# Altium schematic sheet P05_Processor Page 3 of 3.SchDoc
size 513 x 386 mm
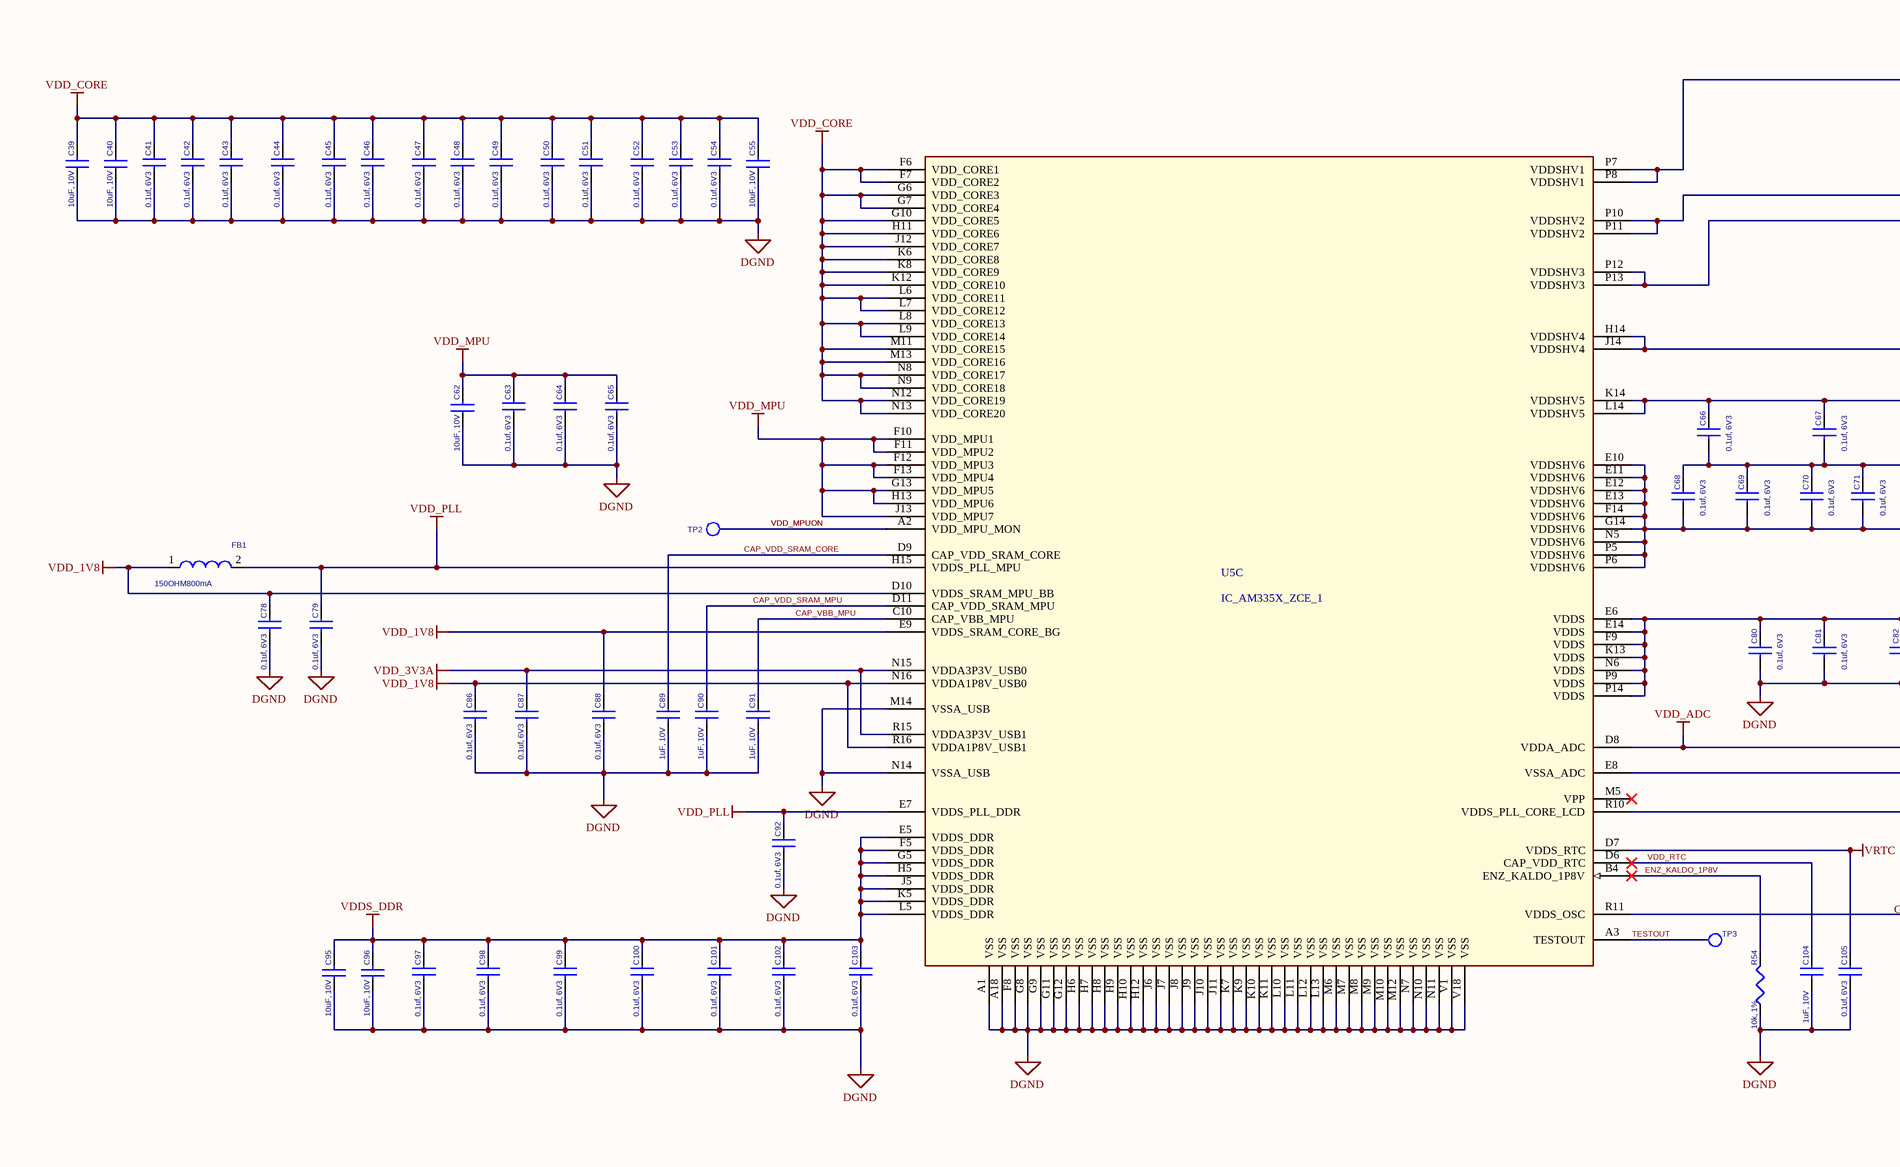
[diagram p0: P05_Processor Page 3 of 3.SchDoc, left]
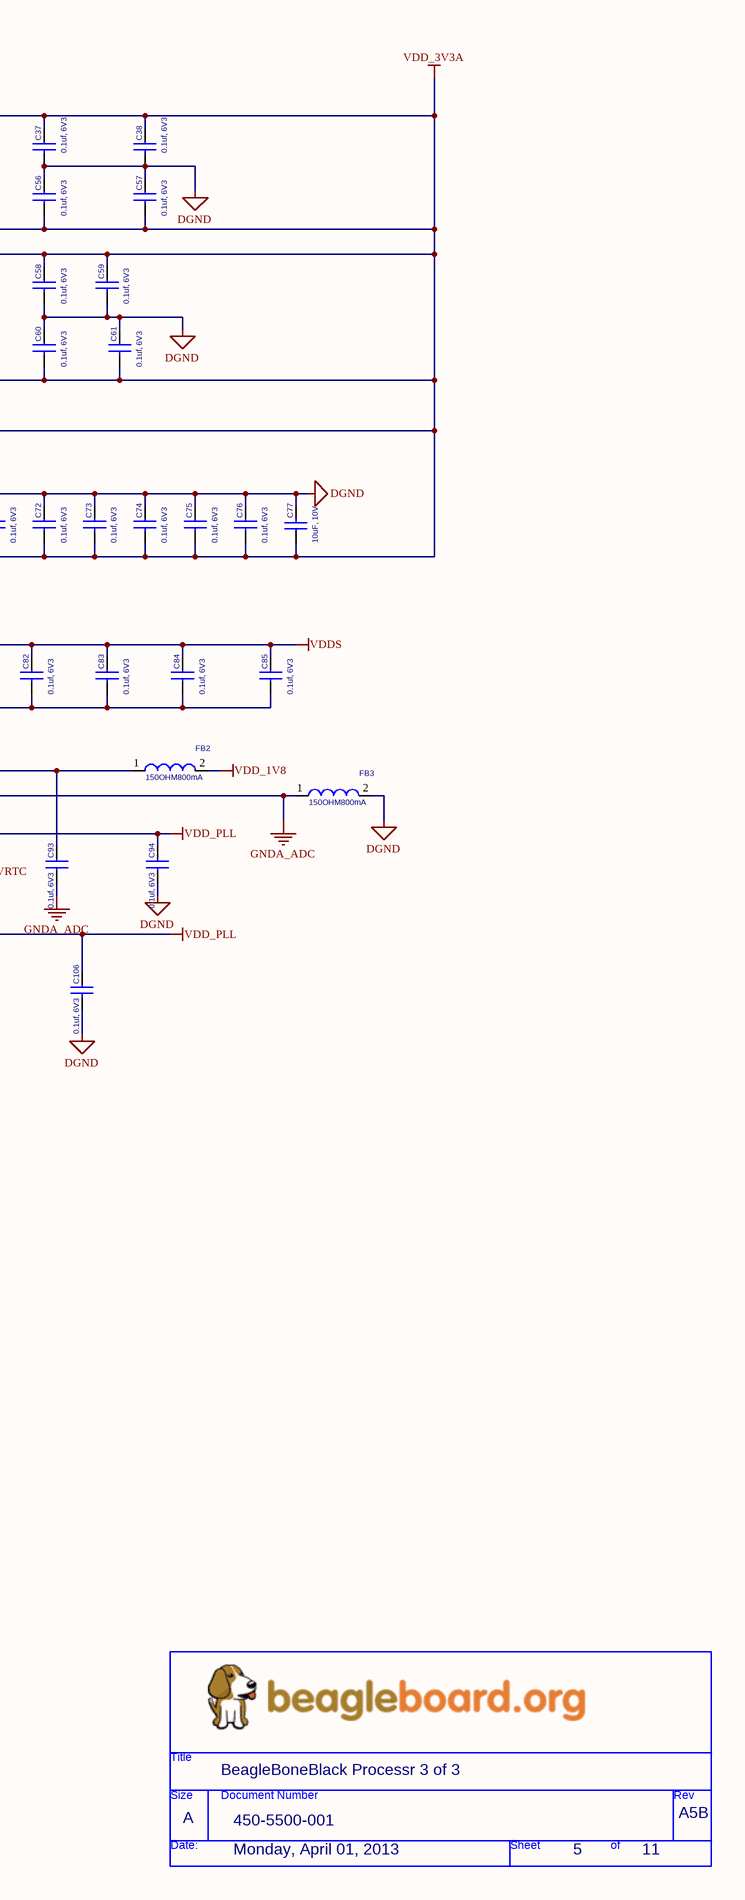
[diagram p1: P05_Processor Page 3 of 3.SchDoc, right]

## Parts
*  Page Create Date: Monday, April 01, 2013  Doc: 450-5500-001  RevCode: A5B  Title: BeagleBoneBlack Processr 3 of 3  Page Size: A  Page Number: 5  Page Count: 11  (hidden comment: BeagleBoard_org)  (graphical)
C37  0.1uf, 6V3  [402]
C38  0.1uf, 6V3  [402]
C39  10uF, 10V  [805]
C40  10uF, 10V  [805]
C41  0.1uf, 6V3  [402]
C42  0.1uf, 6V3  [402]
C43  0.1uf, 6V3  [402]
C44  0.1uf, 6V3  [402]
C45  0.1uf, 6V3  [402]
C46  0.1uf, 6V3  [402]
C47  0.1uf, 6V3  [402]
C48  0.1uf, 6V3  [402]
C49  0.1uf, 6V3  [402]
C50  0.1uf, 6V3  [402]
C51  0.1uf, 6V3  [402]
C52  0.1uf, 6V3  [402]
C53  0.1uf, 6V3  [402]
C54  0.1uf, 6V3  [402]
C55  10uF, 10V  [805]
C56  0.1uf, 6V3  [402]
C57  0.1uf, 6V3  [402]
C58  0.1uf, 6V3  [402]
C59  0.1uf, 6V3  [402]
C60  0.1uf, 6V3  [402]
C61  0.1uf, 6V3  [402]
C62  10uF, 10V  [805]
C63  0.1uf, 6V3  [402]
C64  0.1uf, 6V3  [402]
C65  0.1uf, 6V3  [402]
C66  0.1uf, 6V3  [402]
C67  0.1uf, 6V3  [402]
C68  0.1uf, 6V3  [402]
C69  0.1uf, 6V3  [402]
C70  0.1uf, 6V3  [402]
C71  0.1uf, 6V3  [402]
C72  0.1uf, 6V3  [402]
C73  0.1uf, 6V3  [402]
C74  0.1uf, 6V3  [402]
C75  0.1uf, 6V3  [402]
C76  0.1uf, 6V3  [402]
C77  10uF, 10V  [805]
C78  0.1uf, 6V3  [402]
C79  0.1uf, 6V3  [402]
C80  0.1uf, 6V3  [402]
C81  0.1uf, 6V3  [402]
C82  0.1uf, 6V3  [402]
C83  0.1uf, 6V3  [402]
C84  0.1uf, 6V3  [402]
C85  0.1uf, 6V3  [402]
C86  0.1uf, 6V3  [402]
C87  0.1uf, 6V3  [402]
C88  0.1uf, 6V3  [402]
C89  1uF, 10V  [402]
C90  1uF, 10V  [402]
C91  1uF, 10V  [402]
C92  0.1uf, 6V3  [402]
C93  0.1uf, 6V3  [402]
C94  0.1uf, 6V3  [402]
C95  10uF, 10V  [805]
C96  10uF, 10V  [805]
C97  0.1uf, 6V3  [402]
C98  0.1uf, 6V3  [402]
C99  0.1uf, 6V3  [402]
C100  0.1uf, 6V3  [402]
C101  0.1uf, 6V3  [402]
C102  0.1uf, 6V3  [402]
C103  0.1uf, 6V3  [402]
C104  1uF, 10V  [402]
C105  0.1uf, 6V3  [402]
C106  0.1uf, 6V3  [402]
FB1  150OHM800mA  [SM-7351-IND-0805]
FB2  150OHM800mA  [SM-7351-IND-0805]
FB3  150OHM800mA  [SM-7351-IND-0805]
R54  10k, 1%  [402]
TP2  TESTPT1  [TP60C_SMD]  (value not drawn)  (no BOM)
TP3  TESTPT1  [TP60C_SMD]  (value not drawn)  (no BOM)
U5  IC_AM335X_ZCE_1  [am33xx_15x15]  (part C of 3)

## Nets
DGND: C37.2 C38.2 C39.1 C40.1 C41.2 C42.2 C43.2 C44.2 C45.2 C46.2 C47.2 C48.2 C49.2 C50.2 C51.2 C52.2 C53.2 C54.2 C55.1 C56.1 C57.1 C58.2 C59.2 C60.1 C61.1 C62.1 C63.2 C64.2 C65.2 C66.2 C67.2 C68.1 C69.1 C70.1 C71.1 C72.1 C73.1 C74.1 C75.1 C76.1 C77.2 C78.2 C79.2 C80.2 C81.2 C82.2 C83.2 C84.2 C85.2 C86.2 C87.2 C88.2 C89.2 C90.2 C91.2 C92.2 C94.2 C95.1 C96.1 C97.2 C98.2 C99.2 C100.2 C101.2 C102.2 C103.2 C104.2 C105.2 C106.2 FB3.2 R54.1 U5.A1(VSS) U5.A18(VSS) U5.F8(VSS) U5.G8(VSS) U5.G9(VSS) U5.G11(VSS) U5.G12(VSS) U5.H6(VSS) U5.H7(VSS) U5.H8(VSS) U5.H9(VSS) U5.H10(VSS) U5.H12(VSS) U5.J6(VSS) U5.J7(VSS) U5.J8(VSS) U5.J9(VSS) U5.J10(VSS) U5.J11(VSS) U5.K7(VSS) U5.K9(VSS) U5.K10(VSS) U5.K11(VSS) U5.L10(VSS) U5.L11(VSS) U5.L12(VSS) U5.L13(VSS) U5.M6(VSS) U5.M7(VSS) U5.M8(VSS) U5.M9(VSS) U5.M10(VSS) U5.M12(VSS) U5.M14(VSSA_USB) U5.N7(VSS) U5.N10(VSS) U5.N11(VSS) U5.N14(VSSA_USB) U5.V1(VSS) U5.V18(VSS)
GNDA_ADC: C93.2 FB3.1 U5.E8(VSSA_ADC)
VDD_1V8: C78.1 C86.1 C88.1 FB1.1 FB2.2 U5.D10(VDDS_SRAM_MPU_BB) U5.E9(VDDS_SRAM_CORE_BG) U5.N16(VDDA1P8V_USB0) U5.R16(VDDA1P8V_USB1)
VDD_3V3A: C37.1 C38.1 C56.2 C57.2 C58.1 C59.1 C60.2 C61.2 C66.1 C67.1 C68.2 C69.2 C70.2 C71.2 C72.2 C73.2 C74.2 C75.2 C76.2 C77.1 C87.1 U5.E10(VDDSHV6) U5.E11(VDDSHV6) U5.E12(VDDSHV6) U5.E13(VDDSHV6) U5.F14(VDDSHV6) U5.G14(VDDSHV6) U5.H14(VDDSHV4) U5.J14(VDDSHV4) U5.K14(VDDSHV5) U5.L14(VDDSHV5) U5.N5(VDDSHV6) U5.N15(VDDA3P3V_USB0) U5.P5(VDDSHV6) U5.P6(VDDSHV6) U5.P7(VDDSHV1) U5.P8(VDDSHV1) U5.P10(VDDSHV2) U5.P11(VDDSHV2) U5.P12(VDDSHV3) U5.P13(VDDSHV3) U5.R15(VDDA3P3V_USB1)
VDD_ADC: C93.1 FB2.1 U5.D8(VDDA_ADC)
VDD_CORE: C39.2 C40.2 C41.1 C42.1 C43.1 C44.1 C45.1 C46.1 C47.1 C48.1 C49.1 C50.1 C51.1 C52.1 C53.1 C54.1 C55.2 U5.F6(VDD_CORE1) U5.F7(VDD_CORE2) U5.G6(VDD_CORE3) U5.G7(VDD_CORE4) U5.G10(VDD_CORE5) U5.H11(VDD_CORE6) U5.J12(VDD_CORE7) U5.K6(VDD_CORE8) U5.K8(VDD_CORE9) U5.K12(VDD_CORE10) U5.L6(VDD_CORE11) U5.L7(VDD_CORE12) U5.L8(VDD_CORE13) U5.L9(VDD_CORE14) U5.M11(VDD_CORE15) U5.M13(VDD_CORE16) U5.N8(VDD_CORE17) U5.N9(VDD_CORE18) U5.N12(VDD_CORE19) U5.N13(VDD_CORE20)
VDD_MPU: C62.2 C63.1 C64.1 C65.1 U5.F10(VDD_MPU1) U5.F11(VDD_MPU2) U5.F12(VDD_MPU3) U5.F13(VDD_MPU4) U5.G13(VDD_MPU5) U5.H13(VDD_MPU6) U5.J13(VDD_MPU7)
VDD_PLL: C79.1 C92.1 C94.1 C106.1 FB1.2 U5.E7(VDDS_PLL_DDR) U5.H15(VDDS_PLL_MPU) U5.R10(VDDS_PLL_CORE_LCD) U5.R11(VDDS_OSC)
VDDS: C80.1 C81.1 C82.1 C83.1 C84.1 C85.1 U5.E6(VDDS) U5.E14(VDDS) U5.F9(VDDS) U5.K13(VDDS) U5.N6(VDDS) U5.P9(VDDS) U5.P14(VDDS)
VDDS_DDR: C95.2 C96.2 C97.1 C98.1 C99.1 C100.1 C101.1 C102.1 C103.1 U5.E5(VDDS_DDR) U5.F5(VDDS_DDR) U5.G5(VDDS_DDR) U5.H5(VDDS_DDR) U5.J5(VDDS_DDR) U5.K5(VDDS_DDR) U5.L5(VDDS_DDR)
VRTC: C105.1 U5.D7(VDDS_RTC)
CAP_VBB_MPU: C91.1 U5.C10(CAP_VBB_MPU)
CAP_VDD_SRAM_CORE: C89.1 U5.D9(CAP_VDD_SRAM_CORE)
CAP_VDD_SRAM_MPU: C90.1 U5.D11(CAP_VDD_SRAM_MPU)
ENZ_KALDO_1P8V: R54.2 U5.B4(ENZ_KALDO_1P8V)
TESTOUT: TP3.1(TP) U5.A3(TESTOUT)
VDD_MPUON: TP2.1(TP) U5.A2(VDD_MPU_MON)
VDD_RTC: C104.1 U5.D6(CAP_VDD_RTC)

Not connected (* = marked no-connect by the designer): U5 M5(VPP)*

## Notes on the sheet
- (in symbol BeagleBoard_org) Title; Size; Document Number; Rev; Date:; Sheet; of

## Library data of the parts
C37 C38 C41-C54 C56-C61 C63-C76 C78-C88 C92-C94 C97-C103 C105 C106 = CAP_0.1uF_X7R_16V_10% 0402: CAP CER 0.1UF 6.3V 10% X5R 0402; Manufacturer: TDK Corporation; Manufacturer Part Number: C1005X5R0J104K050BA; Capacitance: 0.1µF; Supplier 1: Digi-Key; Supplier Part Number 1: 445-1266-6-ND; RoHS: RoHS Compliant; Category: Capacitors; Stock 1: 127604; Pricing 1: 1=0.1, 10=0.026, 100=0.0121, 250=0.00992, 500=0.00848, 1000=0.0066, 5000=0.0055 (USD); Voltage - Rated: 6.3V; Tolerance: ±10%; Temperature Coefficient: X5R; Mounting Type: Surface Mount, MLCC; Operating Temperature: -55°C ~ 85°C; Applications: General Purpose; Ratings: -; Package / Case: 0402 (1005 Metric); Size / Dimension: 0.039" L x 0.020" W (1.00mm x 0.50mm); Height - Seated (Max): -; Thickness (Max): 0.022" (0.55mm); Lead Spacing: -; Features: -; Packaging: Digi-Reel®; Lead Style: -; ComponentLink1URL: http://www.kemet.com/datasheets&C0402C104K4RACTU; ComponentLink1Description: http://www.kemet.com/datasheets&C0402C104K4RACTU
C39 C55 C62 C77 C95 C96 = CAP_10uF_Y5V_10V_10%_0805: CAP CER 10UF 10V Y5V 0805; Manufacturer: TDK Corporation; Manufacturer Part Number: C2012Y5V1A106Z; Capacitance: 10µF; Tolerance: -20%, +80%; Temperature Coefficient: Y5V (F); Supplier 1: Digi-Key; Supplier Part Number 1: 445-1371-6-ND; RoHS: RoHS Compliant; Category: Capacitors; Stock 1: 111942; Pricing 1: 1=0.15, 10=0.105, 100=0.0499, 250=0.042, 500=0.03518, 1000=0.02887 (USD); Voltage - Rated: 10V; Mounting Type: Surface Mount, MLCC; Operating Temperature: -30°C ~ 85°C; Applications: General Purpose; Ratings: -; Package / Case: 0805 (2012 Metric); Size / Dimension: 0.079" L x 0.049" W (2.00mm x 1.25mm); Height - Seated (Max): -; Thickness (Max): 0.057" (1.45mm); Lead Spacing: -; Features: -; Packaging: Digi-Reel®; Lead Style: -; ComponentLink1URL: http://media.digikey.com/pdf/Data%20Sheets/TDK%20PDFs/C_Series_GeneralAppl_B11.pdf; ComponentLink1Description: http://media.digikey.com/pdf/Data%20Sheets/TDK%20PDFs/C_Series_GeneralAppl_B11.pdf
C40 = CAP_10uF_Y5V_10V_10%_0805: CAP CER 10UF 10V Y5V 0805; Manufacturer: TDK Corporation; Manufacturer Part Number: C2012Y5V1A106Z; Capacitance: 10µF; Temperature Coefficient: Y5V (F); Tolerance: -20%, +80%; Applications: General Purpose; Category: Capacitors; ComponentLink1Description: http://media.digikey.com/pdf/Data%20Sheets/TDK%20PDFs/C_Series_GeneralAppl_B11.pdf; ComponentLink1URL: http://media.digikey.com/pdf/Data%20Sheets/TDK%20PDFs/C_Series_GeneralAppl_B11.pdf; Features: -; Height - Seated (Max): -; Lead Spacing: -; Lead Style: -; Mounting Type: Surface Mount, MLCC; Operating Temperature: -30°C ~ 85°C; Package / Case: 0805 (2012 Metric); Packaging: Digi-Reel®; Pricing 1: 1=0.15, 10=0.105, 100=0.0499, 250=0.042, 500=0.03518, 1000=0.02887 (USD); Ratings: -; RoHS: RoHS Compliant; Size / Dimension: 0.079" L x 0.049" W (2.00mm x 1.25mm); Stock 1: 111942; Supplier 1: Digi-Key; Supplier Part Number 1: 445-1371-6-ND; Thickness (Max): 0.057" (1.45mm); Voltage - Rated: 10V
C89-C91 C104 = CAP_1.0UF_X5R_10V_10%_0402: CAP CER 1UF 10V 10% X5R 0402; Manufacturer: AVX Corporation; Manufacturer Part Number: 0402ZD105KAT2A; Capacitance: 1.0µF; Supplier 1: Digi-Key; Supplier Part Number 1: 478-4596-6-ND; RoHS: RoHS Compliant; Category: Capacitors; Stock 1: 409277; Pricing 1: 1=0.3, 10=0.25, 100=0.125, 250=0.09376, 500=0.08282, 1000=0.07344, 5000=0.06094 (USD); Voltage - Rated: 10V; Tolerance: ±10%; Temperature Coefficient: X5R; Mounting Type: Surface Mount, MLCC; Operating Temperature: -55°C ~ 85°C; Applications: General Purpose; Ratings: -; Package / Case: 0402 (1005 Metric); Size / Dimension: 0.039" L x 0.020" W (1.00mm x 0.50mm); Height - Seated (Max): -; Thickness (Max): 0.022" (0.56mm); Lead Spacing: -; Features: -; Packaging: Digi-Reel®; Lead Style: -; ComponentLink1URL: http://www.avx.com/docs/Catalogs/cx5r.pdf; ComponentLink1Description: http://www.avx.com/docs/Catalogs/cx5r.pdf
FB1-FB3 = FER_180_200_0: FERRITE 800MA 150 OHM 0805 SMD; PartName: FerriteBead150ohm800mA; Mfr: Steward; MfrNum: LI0805H151R-10; TIIntPartnumber: 1L0010; Manufacturer: Laird-Signal Integrity Products; Vendor: Digikey; Impedance @ Frequency: 150 Ohm @ 100MHz; DC Resistance (DCR): 150 mOhm Max; Filter Type: Differential Mode - Single; Supplier 1: Digi-Key; Supplier Part Number 1: 240-2384-6-ND; Manufacturer Part Number: LI0805H151R-10; RoHS: RoHS Compliant; Category: Filters; Stock 1: 3694; Pricing 1: 1=0.1, 10=0.07, 25=0.064, 50=0.0574, 100=0.0421, 250=0.03064, 500=0.02808, 1000=0.02424 (USD); Current Rating: 800mA; Package / Case: 0805 (2012 Metric); Mounting Type: Surface Mount; Packaging: Digi-Reel®; Height (Max): 0.043" (1.10mm); Size / Dimension: 0.079" L x 0.049" W (2.00mm x 1.25mm); ComponentLink1URL: http://www.lairdtech.com/WorkArea/linkit.aspx?LinkIdentifier=id&ItemID=4912; ComponentLink1Description: http://www.lairdtech.com/WorkArea/linkit.aspx?LinkIdentifier=id&ItemID=4912
R54 = RES_10K_1/16W_1%_0402: RES 10K OHM 1/16W 5% 0402 SMD; Manufacturer: Rohm Semiconductor; Manufacturer Part Number: MCR01MZPJ103; Power (Watts): 0.063W, 1/16W; Temperature Coefficient: ±200ppm/°C; Supplier 1: Digi-Key; Supplier Part Number 1: RHM10KJDKR-ND; RoHS: RoHS Compliant; Category: Resistors; Stock 1: 110842; Pricing 1: 1=0.1, 10=0.019, 25=0.014, 100=0.0078, 250=0.00596, 500=0.00476, 1000=0.0035, 5000=0.00251 (USD); Resistance (Ohms): 10k; Composition: Thick Film; Features: Automotive AEC-Q200 Qualified; Tolerance: ±5%; Package / Case: 0402 (1005 Metric); Supplier Device Package: 0402 (1005 Metric); Size / Dimension: 0.039" L x 0.020" W (1.00mm x 0.50mm); Height: 0.016" (0.40mm); Number of Terminations: 2; Packaging: Digi-Reel®; ComponentLink1URL: http://rohmfs.rohm.com/en/products/databook/datasheet/passive/resistor/chip_resistor/mcr_a.pdf; ComponentLink1Description: http://rohmfs.rohm.com/en/products/databook/datasheet/passive/resistor/chip_resistor/mcr_a.pdf
U5 = IC_AM335X_ZCE_1: SubArctic Cortex A8 Processor 15x15; PartName: AM335X_15x15; Mfr: TI; MfrNum: AM335x 15x15 FBGA ZCE; TIIntPartnumber: 1A0242; Manufacturer: Texas Instruments; Manufacturer Part Number: XAM3359ZCZ; Vendor: Arrow; Cost100: 10.00; Processor Type: ARM Microprocessor; Voltage: 1.06 V ~ 1.15 V; Cost10K: 10.00; Part Number: IC_AM335x_ZCE; Supplier 1: Digi-Key; Supplier Part Number 1: 296-35073-ND; RoHS: RoHS Compliant; Category: Integrated Circuits (ICs); Stock 1: 16; Pricing 1: 1=33.5, 10=30.988, 100=26.465, 250=24.28752, 500=23.115, 1000=21.775, 2500=21.105, 5000=20.6025, 10000=20.1 (USD); Features: -; Speed: -; Mounting Type: Surface Mount; Package / Case: 324-LFBGA; Supplier Device Package: 324-NFBGA(15x15); Packaging: Tray; ComponentLink1URL: http://www.ti.com/lit/ds/symlink/am3354.pdf; ComponentLink1Description: http://www.ti.com/lit/ds/symlink/am3354.pdf